# Altium schematic sheet 04_nRF52840_NFC_USB.SchDoc
size 420 x 297 mm; Author: Shpakov Dmitry; Address1: Address1; Address2: Address2; Address3: Address3; Address4: Address4; DocumentNumber: АБВГ.123456.001 Э3; SheetNumber: 5; SheetTotal: 13; Scale: 1:1; DocumentType: Схема электрическая принципиальная; FirstReferrence: АБВГ.123456.001
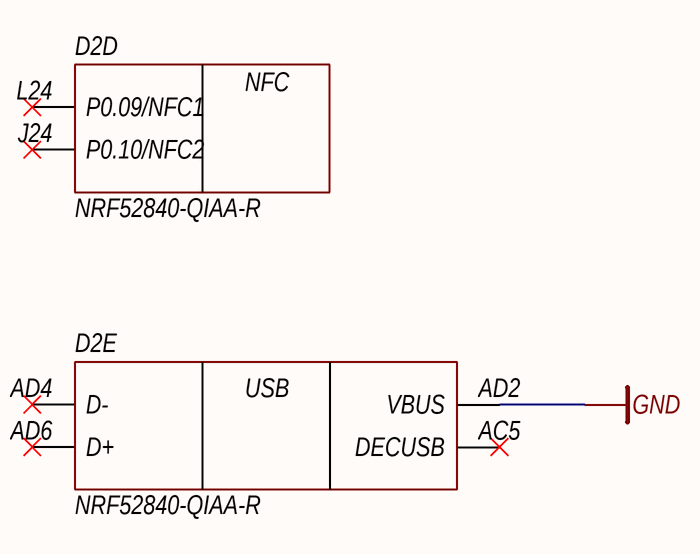
[diagram p0: 04_nRF52840_NFC_USB.SchDoc]

## Parts
D2  NRF52840-QIAA-R  [AQFN50P700X700X85_HS-74N]  (parts D,E of 9)

## Nets
GND: D2.AD2(VBUS)

Not connected (* = marked no-connect by the designer): D2 AC5(DECUSB)* AD4(D-)* AD6(D+)* J24(P0.10/NFC2)* L24(P0.09/NFC1)*

## Notes on the sheet
- Author
- Manufacturer
- Date
- Page
- Total pages
- Size page
- A3
- Materials
- (in symbol nRF52840-QFN373, part D) NFC
- (in symbol nRF52840-QFN373, part E) USB

## Library data of the parts
D2 = nRF52840-QFN373: IC RF TxRx + MCU 802.15.4, Bluetooth Bluetooth v5.0 2.4GHz 73-VFQFN Dual Rows, Exposed Pad; Manufacturer: Nordic Semiconductor ASA; Power/Voltage: 1.7V ~ 5.5V; Operation Temperature: -40...+85; Help URL: https://www.digikey.com/en/products/detail/nexperia-usa-inc/2N7002-215/762973; Type: IC RF TXRX+MCU 802.15.4; Value: *; Tolerance: *; Note: *; Case: 73-aQFN (7x7); PartNumber: NRF52840-QIAA-R